# Altium schematic sheet rasp_sheild_ADC.SchDoc
size Tabloid; SheetNumber: 3; SheetTotal: 5; Sheet_Name: Lecture analogique thermistances; Size: 11x17
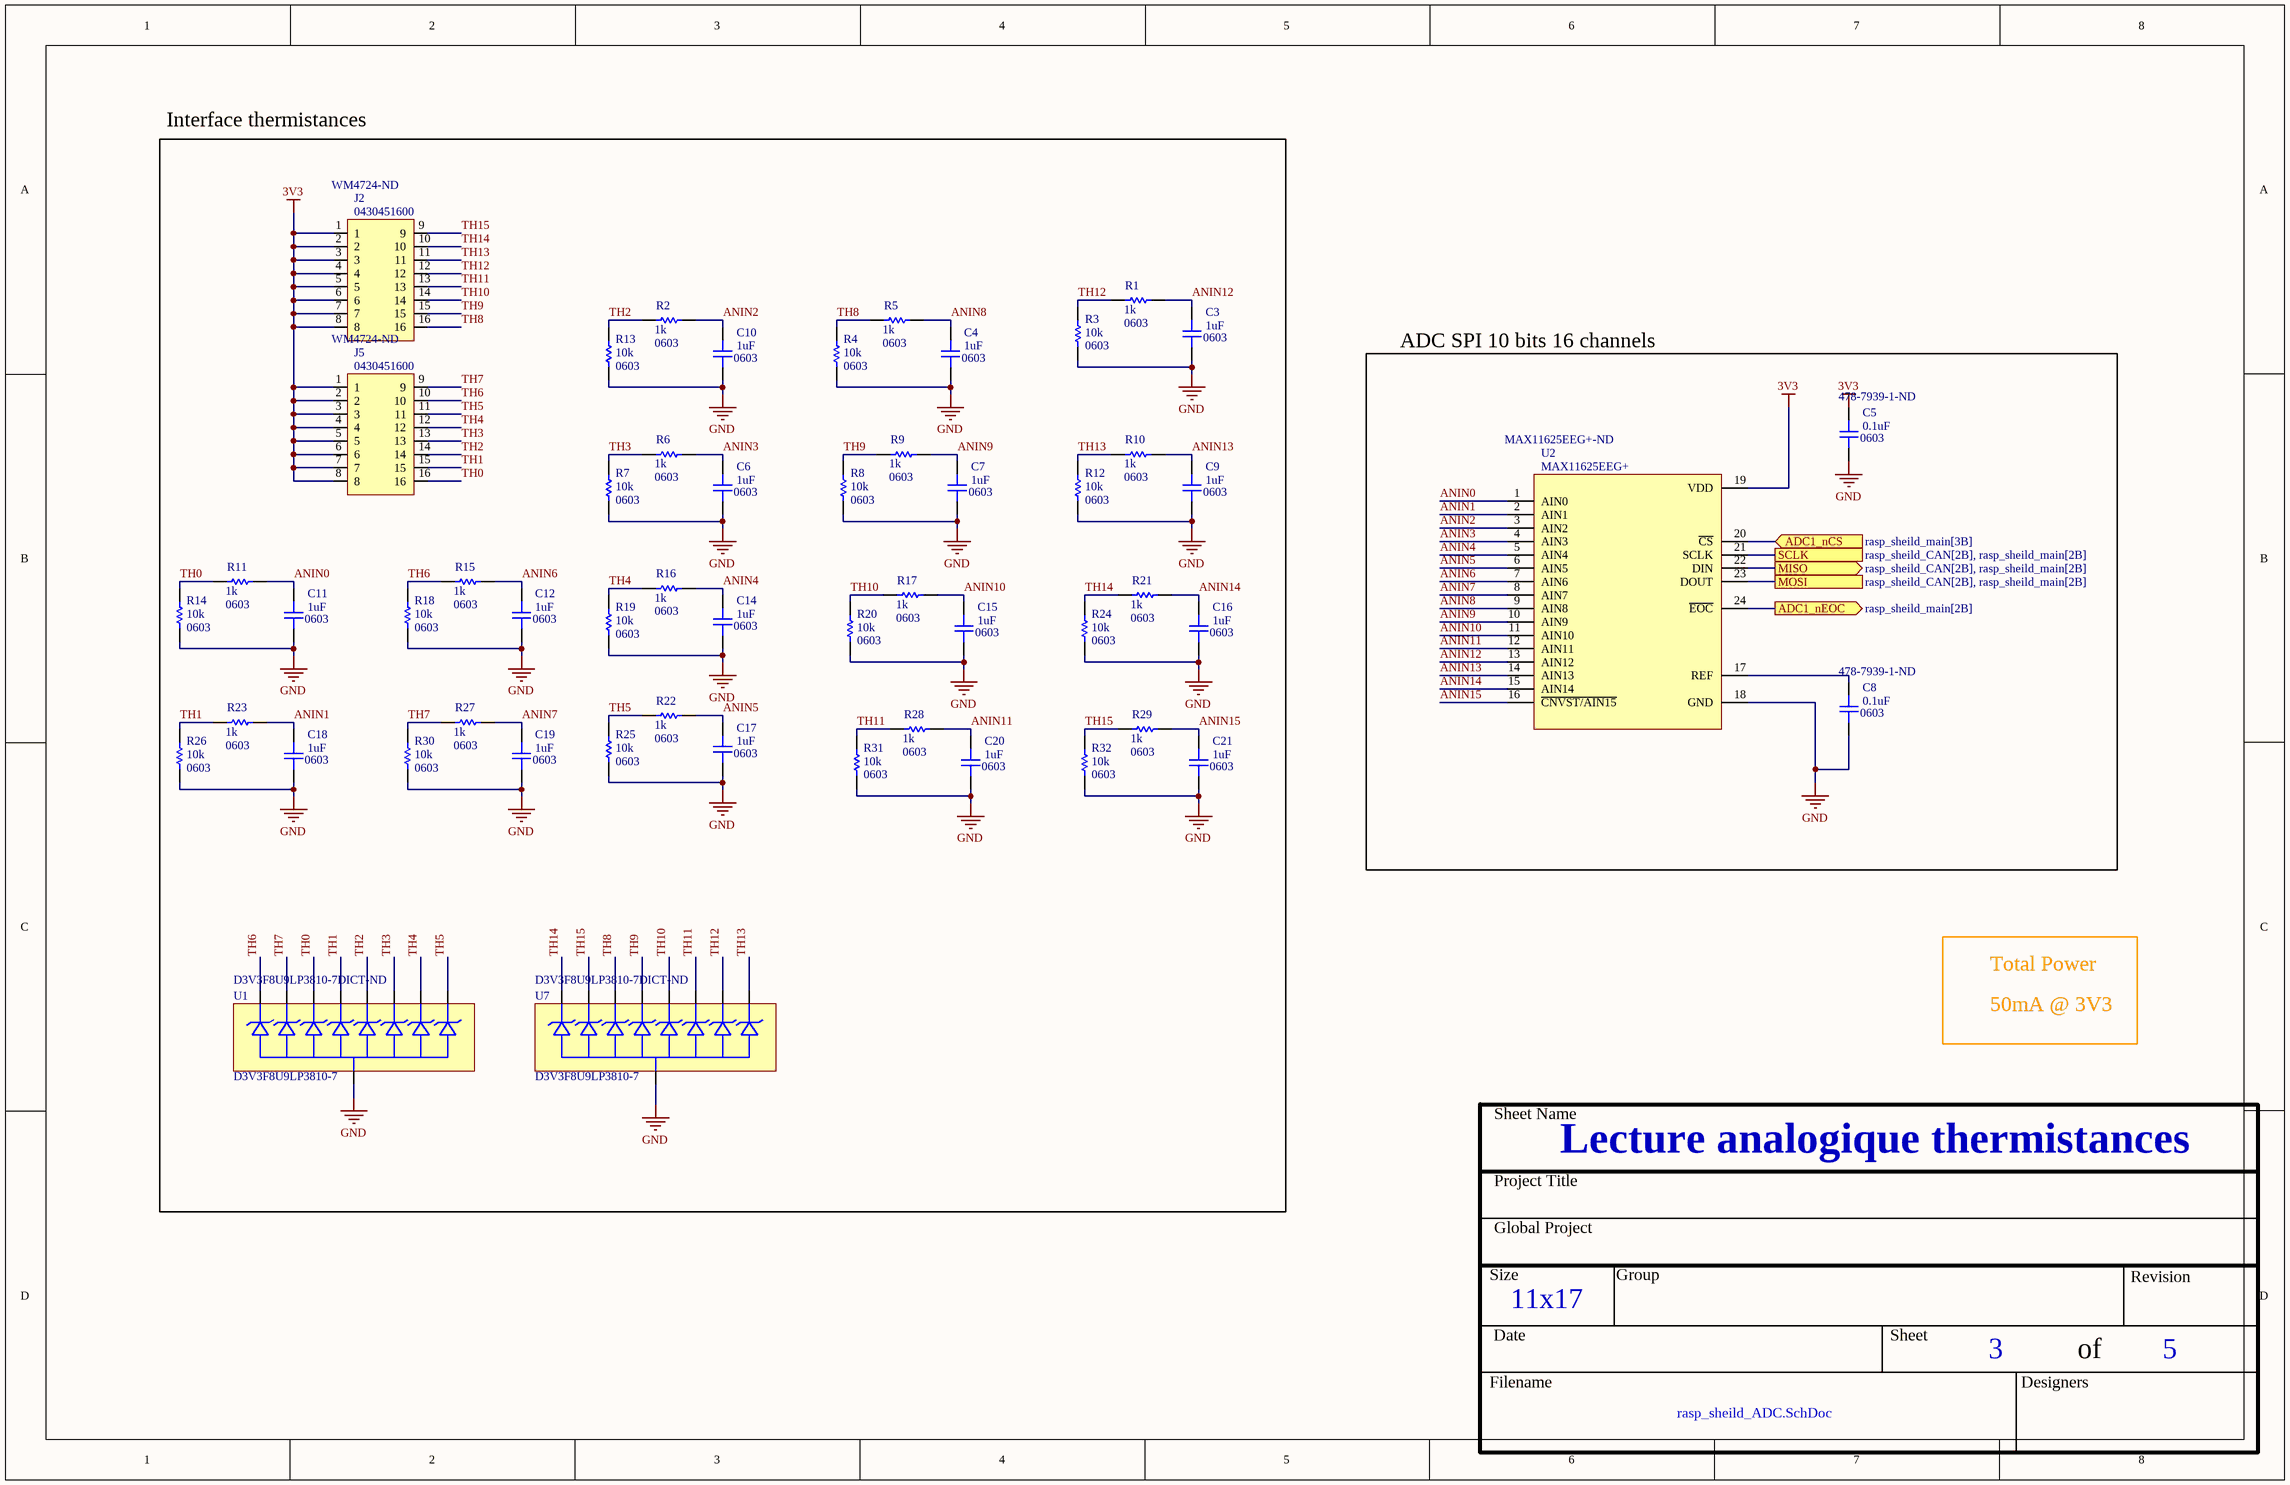
[diagram p0: rasp_sheild_ADC.SchDoc]

## Parts
C3  value 1uF  Package: 0603  [CAP_0603]  (hidden comment: Part Number)
C4  value 1uF  Package: 0603  [CAP_0603]  (hidden comment: Part Number)
C5  value 0.1uF  Package: 0603  Supplier Part Number 1: 478-7939-1-ND  [CAP_0603]  (hidden comment: Part Number)
C6  value 1uF  Package: 0603  [CAP_0603]  (hidden comment: Part Number)
C7  value 1uF  Package: 0603  [CAP_0603]  (hidden comment: Part Number)
C8  value 0.1uF  Package: 0603  Supplier Part Number 1: 478-7939-1-ND  [CAP_0603]  (hidden comment: Part Number)
C9  value 1uF  Package: 0603  [CAP_0603]  (hidden comment: Part Number)
C10  value 1uF  Package: 0603  [CAP_0603]  (hidden comment: Part Number)
C11  value 1uF  Package: 0603  [CAP_0603]  (hidden comment: Part Number)
C12  value 1uF  Package: 0603  [CAP_0603]  (hidden comment: Part Number)
C14  value 1uF  Package: 0603  [CAP_0603]  (hidden comment: Part Number)
C15  value 1uF  Package: 0603  [CAP_0603]  (hidden comment: Part Number)
C16  value 1uF  Package: 0603  [CAP_0603]  (hidden comment: Part Number)
C17  value 1uF  Package: 0603  [CAP_0603]  (hidden comment: Part Number)
C18  value 1uF  Package: 0603  [CAP_0603]  (hidden comment: Part Number)
C19  value 1uF  Package: 0603  [CAP_0603]  (hidden comment: Part Number)
C20  value 1uF  Package: 0603  [CAP_0603]  (hidden comment: Part Number)
C21  value 1uF  Package: 0603  [CAP_0603]  (hidden comment: Part Number)
J2  0430451600  Supplier Part Number 1: WM4724-ND  [0430451600]
J5  0430451600  Supplier Part Number 1: WM4724-ND  [0430451600]
R1  value 1k  Package: 0603  [RES_0603]  (hidden comment: Part Number)
R2  value 1k  Package: 0603  [RES_0603]  (hidden comment: Part Number)
R3  value 10k  Package: 0603  [RES_0603]  (hidden comment: Part Number)
R4  value 10k  Package: 0603  [RES_0603]  (hidden comment: Part Number)
R5  value 1k  Package: 0603  [RES_0603]  (hidden comment: Part Number)
R6  value 1k  Package: 0603  [RES_0603]  (hidden comment: Part Number)
R7  value 10k  Package: 0603  [RES_0603]  (hidden comment: Part Number)
R8  value 10k  Package: 0603  [RES_0603]  (hidden comment: Part Number)
R9  value 1k  Package: 0603  [RES_0603]  (hidden comment: Part Number)
R10  value 1k  Package: 0603  [RES_0603]  (hidden comment: Part Number)
R11  value 1k  Package: 0603  [RES_0603]  (hidden comment: Part Number)
R12  value 10k  Package: 0603  [RES_0603]  (hidden comment: Part Number)
R13  value 10k  Package: 0603  [RES_0603]  (hidden comment: Part Number)
R14  value 10k  Package: 0603  [RES_0603]  (hidden comment: Part Number)
R15  value 1k  Package: 0603  [RES_0603]  (hidden comment: Part Number)
R16  value 1k  Package: 0603  [RES_0603]  (hidden comment: Part Number)
R17  value 1k  Package: 0603  [RES_0603]  (hidden comment: Part Number)
R18  value 10k  Package: 0603  [RES_0603]  (hidden comment: Part Number)
R19  value 10k  Package: 0603  [RES_0603]  (hidden comment: Part Number)
R20  value 10k  Package: 0603  [RES_0603]  (hidden comment: Part Number)
R21  value 1k  Package: 0603  [RES_0603]  (hidden comment: Part Number)
R22  value 1k  Package: 0603  [RES_0603]  (hidden comment: Part Number)
R23  value 1k  Package: 0603  [RES_0603]  (hidden comment: Part Number)
R24  value 10k  Package: 0603  [RES_0603]  (hidden comment: Part Number)
R25  value 10k  Package: 0603  [RES_0603]  (hidden comment: Part Number)
R26  value 10k  Package: 0603  [RES_0603]  (hidden comment: Part Number)
R27  value 1k  Package: 0603  [RES_0603]  (hidden comment: Part Number)
R28  value 1k  Package: 0603  [RES_0603]  (hidden comment: Part Number)
R29  value 1k  Package: 0603  [RES_0603]  (hidden comment: Part Number)
R30  value 10k  Package: 0603  [RES_0603]  (hidden comment: Part Number)
R31  value 10k  Package: 0603  [RES_0603]  (hidden comment: Part Number)
R32  value 10k  Package: 0603  [RES_0603]  (hidden comment: Part Number)
U1  D3V3F8U9LP3810-7  Supplier Part Number 1: D3V3F8U9LP3810-7DICT-ND  [D3V3F8U9LP3810-7]
U2  MAX11625EEG+  Supplier Part Number 1: MAX11625EEG+-ND  [24-QSSOP]
U7  D3V3F8U9LP3810-7  Supplier Part Number 1: D3V3F8U9LP3810-7DICT-ND  [D3V3F8U9LP3810-7]

## Blocks framed on the sheet
Interface thermistances: C3 C4 C6 C7 C9-C12 C14-C21 J2 J5 R1-R32 U1 U7
ADC SPI 10 bits 16 channels: C5 C8 U2

## Ports
ADC1_nCS (in, see rasp_sheild_main[3B]), ADC1_nEOC (out, see rasp_sheild_main[2B]), MISO (out, see rasp_sheild_CAN[2B], rasp_sheild_main[2B]), MOSI (see rasp_sheild_CAN[2B], rasp_sheild_main[2B]), SCLK (see rasp_sheild_CAN[2B], rasp_sheild_main[2B])

## Nets
3V3: C5.2 J2.1 J2.2 J2.3 J2.4 J2.5 J2.6 J2.7 J2.8 J5.1 J5.2 J5.3 J5.4 J5.5 J5.6 J5.7 J5.8 U2.19(VDD)
GND: C3.1 C4.1 C5.1 C6.1 C7.1 C8.1 C9.1 C10.1 C11.1 C12.1 C14.1 C15.1 C16.1 C17.1 C18.1 C19.1 C20.1 C21.1 R3.2 R4.2 R7.2 R8.2 R12.2 R13.2 R14.2 R18.2 R19.2 R20.2 R24.2 R25.2 R26.2 R30.2 R31.2 R32.2 U1.3 U2.18(GND) U7.3
ADC1_nCS: U2.20(~{CS}) ; port ADC1_nCS
ADC1_nEOC: U2.24(~{EOC}) ; port ADC1_nEOC
ANIN0: C11.2 R11.1 U2.1(AIN0)
ANIN1: C18.2 R23.1 U2.2(AIN1)
ANIN2: C10.2 R2.1 U2.3(AIN2)
ANIN3: C6.2 R6.1 U2.4(AIN3)
ANIN4: C14.2 R16.1 U2.5(AIN4)
ANIN5: C17.2 R22.1 U2.6(AIN5)
ANIN6: C12.2 R15.1 U2.7(AIN6)
ANIN7: C19.2 R27.1 U2.8(AIN7)
ANIN8: C4.2 R5.1 U2.9(AIN8)
ANIN9: C7.2 R9.1 U2.10(AIN9)
ANIN10: C15.2 R17.1 U2.11(AIN10)
ANIN11: C20.2 R28.1 U2.12(AIN11)
ANIN12: C3.2 R1.1 U2.13(AIN12)
ANIN13: C9.2 R10.1 U2.14(AIN13)
ANIN14: C16.2 R21.1 U2.15(AIN14)
ANIN15: C21.2 R29.1 U2.16(~{CNVST/AIN15})
MISO: U2.22(DIN) ; port MISO
MOSI: U2.23(DOUT) ; port MOSI
SCLK: U2.21(SCLK) ; port SCLK
TH0: J5.16 R11.2 R14.1 U1.4
TH1: J5.15 R23.2 R26.1 U1.5
TH2: J5.14 R2.2 R13.1 U1.6
TH3: J5.13 R6.2 R7.1 U1.7
TH4: J5.12 R16.2 R19.1 U1.8
TH5: J5.11 R22.2 R25.1 U1.9
TH6: J5.10 R15.2 R18.1 U1.1
TH7: J5.9 R27.2 R30.1 U1.2
TH8: J2.16 R4.1 R5.2 U7.4
TH9: J2.15 R8.1 R9.2 U7.5
TH10: J2.14 R17.2 R20.1 U7.6
TH11: J2.13 R28.2 R31.1 U7.7
TH12: J2.12 R1.2 R3.1 U7.8
TH13: J2.11 R10.2 R12.1 U7.9
TH14: J2.10 R21.2 R24.1 U7.1
TH15: J2.9 R29.2 R32.1 U7.2
NetC8_2: C8.2 U2.17(REF)

## Notes on the sheet
- Total Power
- 50mA @ 3V3
- Sheet Name
- Project Title
- Global Project
- Size
- Group
- Revision
- Date
- Sheet
- of
- Filename
- Designers

## Library data of the parts
C3-C12 C14-C21 = CAP_0603: XXX - Description - Package; GRAMS Lib Spec: 2.7; Supplier 1: Digi-Key
  C3 C4 C6 C7 C9-C12 C14-C21: Supplier Part Number 1: 399-C0603C105K8RAC7867CT-ND
J2 J5 = 0430451600: Connector Header Through Hole, Right Angle 16 position 0.118" (3.00mm); GRAMS Lib Spec: 2.7; Supplier 1: Digi-Key
R1-R32 = RES_0603: XXX - Description - Package; GRAMS Lib Spec: 2.7; Supplier 1: Digi-Key
  R1 R2 R5 R6 R9-R11 R15-R17 R21-R23 R27-R29: Supplier Part Number 1: 311-1.00KHRCT-ND
  R3 R4 R7 R8 R12-R14 R18-R20 R24-R26 R30-R32: Supplier Part Number 1: 311-10.0KHRCT-ND
U1 U7 = D3V3F8U9LP3810-7: 5V (Typ) Clamp 5A (8/20µs) Ipp Tvs Diode Surface Mount U-DFN3810-9 (Type B); GRAMS Lib Spec: 2.7; Supplier 1: Digi-Key
U2 = MAX11625EEG+: 10 Bit Analog to Digital Converter 16 Input 1 SAR 24-QSOP; GRAMS Lib Spec: 2.7; Supplier 1: Digi-Key